# Altium schematic sheet BALL-E-Main.SchDoc
size A
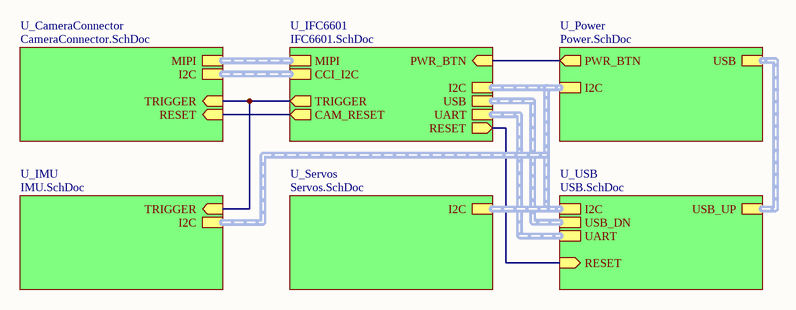
[diagram p0: BALL-E-Main.SchDoc]

## Sub-sheets
U_CameraConnector = CameraConnector.SchDoc: I2C (harness I2C), TRIGGER (in), RESET (in), MIPI (harness MIPI)
U_IFC6601 = IFC6601.SchDoc: PWR_BTN (in), UART (harness UART), USB (harness USB), I2C (harness I2C), CCI_I2C (harness I2C), RESET (out), CAM_RESET (out), TRIGGER (out), MIPI (harness MIPI)
U_IMU = IMU.SchDoc: I2C (harness I2C), TRIGGER (in)
U_Power = Power.SchDoc: I2C (harness I2C), USB (harness USB), PWR_BTN (out)
U_Servos = Servos.SchDoc: I2C (harness I2C)
U_USB = USB.SchDoc: RESET (in), USB_DN (harness USB), UART (harness UART), USB_UP (harness USB), I2C (harness I2C)

## Nets
(unnamed): sheet U_IFC6601/PWR_BTN, sheet U_Power/PWR_BTN
(unnamed): sheet U_IFC6601/RESET, sheet U_USB/RESET
(unnamed): sheet U_IFC6601/CAM_RESET, sheet U_CameraConnector/RESET
(unnamed): sheet U_IFC6601/TRIGGER, sheet U_CameraConnector/TRIGGER, sheet U_IMU/TRIGGER

## Buses and harness runs
harness sheet U_CameraConnector/I2C = sheet U_IFC6601/CCI_I2C
harness sheet U_CameraConnector/MIPI = sheet U_IFC6601/MIPI
harness sheet U_IFC6601/I2C = sheet U_IMU/I2C = sheet U_Power/I2C = sheet U_Servos/I2C = sheet U_USB/I2C
harness sheet U_IFC6601/UART = sheet U_USB/UART
harness sheet U_IFC6601/USB = sheet U_USB/USB_DN
harness sheet U_Power/USB = sheet U_USB/USB_UP